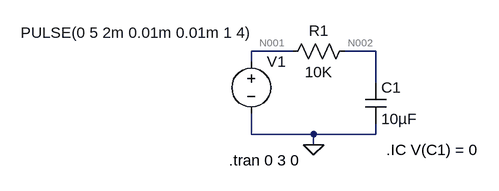
[diagram p0: schematic Draft2.asc]
Draft2.asc, the LTspice schematic file:
Version 4
SHEET 1 880 680
WIRE 192 160 128 160
WIRE 320 160 272 160
WIRE 128 176 128 160
WIRE 320 208 320 160
WIRE 128 288 128 256
WIRE 224 288 128 288
WIRE 320 288 320 272
WIRE 320 288 224 288
WIRE 224 304 224 288
FLAG 224 304 0
SYMBOL cap 304 208 R0
SYMATTR InstName C1
SYMATTR Value 10µF
SYMBOL voltage 128 160 R0
WINDOW 3 -355 -29 Left 2
WINDOW 123 0 0 Left 0
WINDOW 39 0 0 Left 0
SYMATTR InstName V1
SYMATTR Value PULSE(0 5 2m 0.01m 0.01m 1 4)
SYMBOL res 288 144 R90
WINDOW 0 0 56 VBottom 2
WINDOW 3 32 56 VTop 2
SYMATTR InstName R1
SYMATTR Value 10K
TEXT 94 328 Left 2 !.tran 0 3 0
TEXT 336 312 Left 2 !.IC V(C1) = 0

The netlist it stands for:
* Draft2.asc
C1 N002 0 10µF
V1 N001 0 PULSE(0 5 2m 0.01m 0.01m 1 4)
R1 N002 N001 10K
.tran 0 3 0
.IC V(C1) = 0
.backanno
.end

* Results of the author's LTspice run, read from the files saved beside the schematic
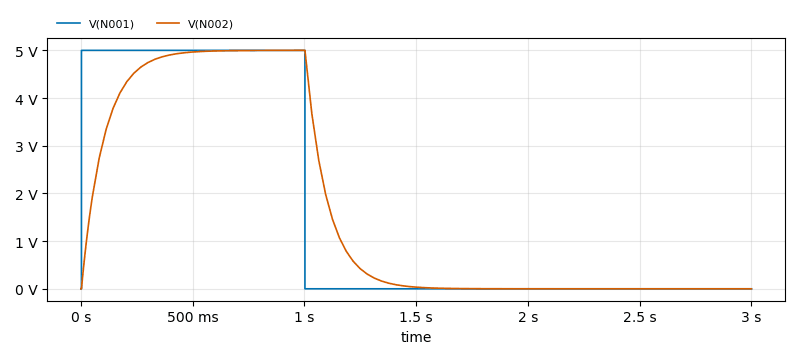
[diagram p1: Transient Analysis of Draft2.asc, plotted from the saved traces]
* Transient Analysis, 1 run:
*   V(N001): min 0 V, max 5 V, average 1.667 V, rms 2.887 V, last 0 V
*   V(N002): min 0 V, max 5 V, average 1.667 V, rms 2.74 V, last 0 V